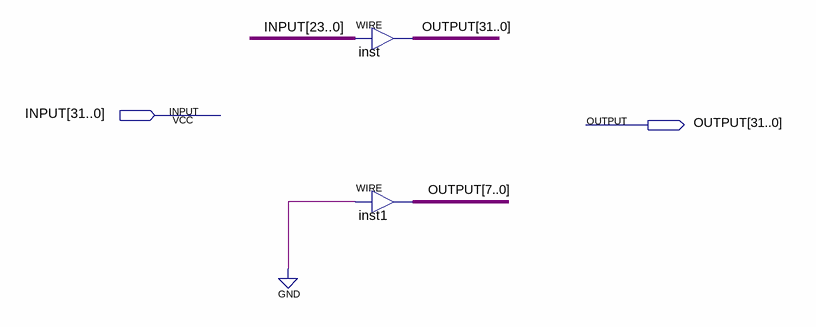
[diagram p0: schematic sheet]
// Quartus schematic SLL8.bdf as structural Verilog: 2 symbols, 2 pins
module SLL8 (
  input  [31:0] INPUT,
  output [31:0] OUTPUT
);

  assign OUTPUT = INPUT[23:0];  // WIRE inst
  assign OUTPUT[7:0] = {8{1'b0}};  // WIRE inst1
endmodule
